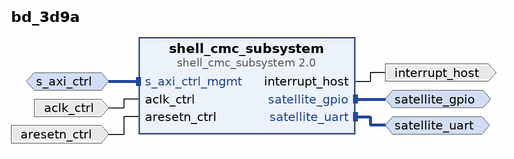
[diagram p0: block diagram of the top level]
# Vivado block design bd_3d9a, xcu200-fsgd2104-2-e, Vivado 2019.2
create_bd_design bd_3d9a

create_bd_intf_port -mode Slave -vlnv xilinx.com:interface:aximm_rtl:1.0 s_axi_ctrl
set_property -dict [list \
  CONFIG.DATA_WIDTH 32 \
  CONFIG.PROTOCOL AXI4LITE \
  CONFIG.FREQ_HZ 50000000 \
  CONFIG.ADDR_WIDTH 18 \
  CONFIG.AWUSER_WIDTH 0 \
  CONFIG.ARUSER_WIDTH 0 \
  CONFIG.WUSER_WIDTH 0 \
  CONFIG.RUSER_WIDTH 0 \
  CONFIG.BUSER_WIDTH 0 \
  CONFIG.READ_WRITE_MODE READ_WRITE \
  CONFIG.HAS_BURST 0 \
  CONFIG.HAS_LOCK 0 \
  CONFIG.HAS_PROT 0 \
  CONFIG.HAS_CACHE 0 \
  CONFIG.HAS_QOS 0 \
  CONFIG.HAS_REGION 0 \
  CONFIG.HAS_WSTRB 1 \
  CONFIG.HAS_BRESP 1 \
  CONFIG.HAS_RRESP 1 \
  CONFIG.SUPPORTS_NARROW_BURST 0 \
  CONFIG.NUM_READ_OUTSTANDING 2 \
  CONFIG.NUM_WRITE_OUTSTANDING 2 \
  CONFIG.MAX_BURST_LENGTH 1 \
  CONFIG.NUM_READ_THREADS 1 \
  CONFIG.NUM_WRITE_THREADS 1 \
  CONFIG.RUSER_BITS_PER_BYTE 0 \
  CONFIG.WUSER_BITS_PER_BYTE 0 \
  CONFIG.INSERT_VIP 1 \
] [get_bd_intf_ports s_axi_ctrl]
create_bd_intf_port -mode Master -vlnv xilinx.com:interface:gpio_rtl:1.0 satellite_gpio
create_bd_intf_port -mode Master -vlnv xilinx.com:interface:uart_rtl:1.0 satellite_uart
create_bd_port -dir I -type clk aclk_ctrl
set_property -dict [list \
  CONFIG.ASSOCIATED_BUSIF s_axi_ctrl \
  CONFIG.ASSOCIATED_RESET aresetn_ctrl \
  CONFIG.INSERT_VIP 0 \
] [get_bd_ports aclk_ctrl]
create_bd_port -dir I -type rst aresetn_ctrl
set_property -dict {CONFIG.INSERT_VIP 0} [get_bd_ports aresetn_ctrl]
create_bd_port -dir O -type intr interrupt_host
set_property -dict {CONFIG.SENSITIVITY LEVEL_HIGH} [get_bd_ports interrupt_host]

create_bd_cell -type ip -vlnv xilinx.com:ip:shell_cmc_subsystem:2.0 shell_cmc_subsystem
set_property -dict [list \
  CONFIG.ENABLE_AXI_IC_PIPELINING false \
  CONFIG.HAS_EXTERNAL_M_AXILITE false \
  CONFIG.HAS_USB_UART false \
  CONFIG.NUM_SATELLITE_GPIO 4 \
] [get_bd_cells shell_cmc_subsystem]

# ---- connections ----

connect_bd_intf_net -intf_net s_axi_ctrl_net [get_bd_intf_ports s_axi_ctrl] [get_bd_intf_pins shell_cmc_subsystem/s_axi_ctrl_mgmt]
connect_bd_intf_net -intf_net satellite_uart_net [get_bd_intf_ports satellite_uart] [get_bd_intf_pins shell_cmc_subsystem/satellite_uart]
connect_bd_intf_net -intf_net satellite_gpio_net [get_bd_intf_ports satellite_gpio] [get_bd_intf_pins shell_cmc_subsystem/satellite_gpio]
connect_bd_net -net aclk_ctrl_net [get_bd_ports aclk_ctrl] [get_bd_pins shell_cmc_subsystem/aclk_ctrl]
connect_bd_net -net aresetn_ctrl_net [get_bd_ports aresetn_ctrl] [get_bd_pins shell_cmc_subsystem/aresetn_ctrl]
connect_bd_net -net interrupt_host_net [get_bd_pins shell_cmc_subsystem/interrupt_host] [get_bd_ports interrupt_host]

# ---- address map ----
assign_bd_address -offset 0x00000 -range 256K -target_address_space [get_bd_addr_spaces s_axi_ctrl] [get_bd_addr_segs shell_cmc_subsystem/s_axi_ctrl_mgmt/Mem]

validate_bd_design
save_bd_design
